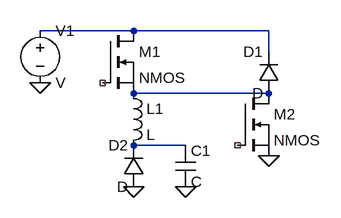
[diagram p0: schematic ripplecompensator2.asc]
ripplecompensator2.asc, the LTspice schematic file:
Version 4
SHEET 1 880 680
WIRE 208 112 64 112
WIRE 416 112 208 112
WIRE 416 144 416 112
WIRE 416 208 208 208
WIRE 288 288 208 288
FLAG 64 192 0
FLAG 288 352 0
FLAG 416 304 0
FLAG 208 352 0
SYMBOL voltage 64 96 R0
SYMATTR InstName V1
SYMBOL nmos 160 112 R0
SYMATTR InstName M1
SYMBOL ind 192 192 R0
SYMATTR InstName L1
SYMBOL cap 272 288 R0
SYMATTR InstName C1
SYMBOL nmos 368 208 R0
SYMATTR InstName M2
SYMBOL diode 432 208 R180
WINDOW 0 24 64 Left 2
WINDOW 3 24 0 Left 2
SYMATTR InstName D1
SYMBOL diode 224 352 R180
WINDOW 0 24 64 Left 2
WINDOW 3 24 0 Left 2
SYMATTR InstName D2

The netlist it stands for:
* ripplecompensator2.asc
V1 N001 0 V
M1 N001 NC_01 N002 N002 NMOS
L1 N002 N003 L
C1 N003 0 C
M2 N002 NC_02 0 0 NMOS
D1 N002 N001 D
D2 0 N003 D
.model D D
.lib standard.dio
.model NMOS NMOS
.model PMOS PMOS
.lib standard.mos
.backanno
.end